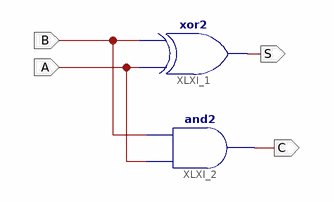
[diagram p0: schematic sheet 1]
// Xilinx ISE schematic SemiSumador.sch (spartan3e) as structural Verilog: 2 symbols, 4 ports
module SemiSumador (
  input  B,
  input  A,
  output S,
  output C
);

  xor XLXI_1 (S, A, B);
  and XLXI_2 (C, A, B);
endmodule
